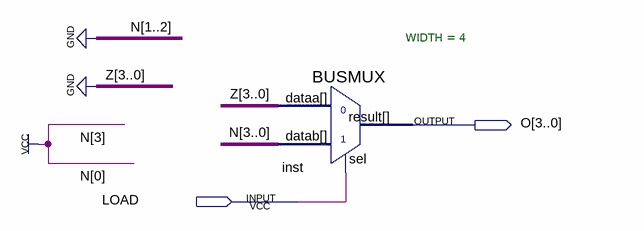
[diagram p0: schematic sheet]
// Quartus schematic dem.bdf as structural Verilog: 1 symbols, 2 pins
module dem (
  input  LOAD,
  output [3:0] O
);

  BUSMUX #(.WIDTH(4)) inst (.datab(4'b1001), .sel(LOAD), .dataa(4'b0000), .result(O));
endmodule
